# EAGLE schematic Microduino-Core BLE (EAGLE 6.4)
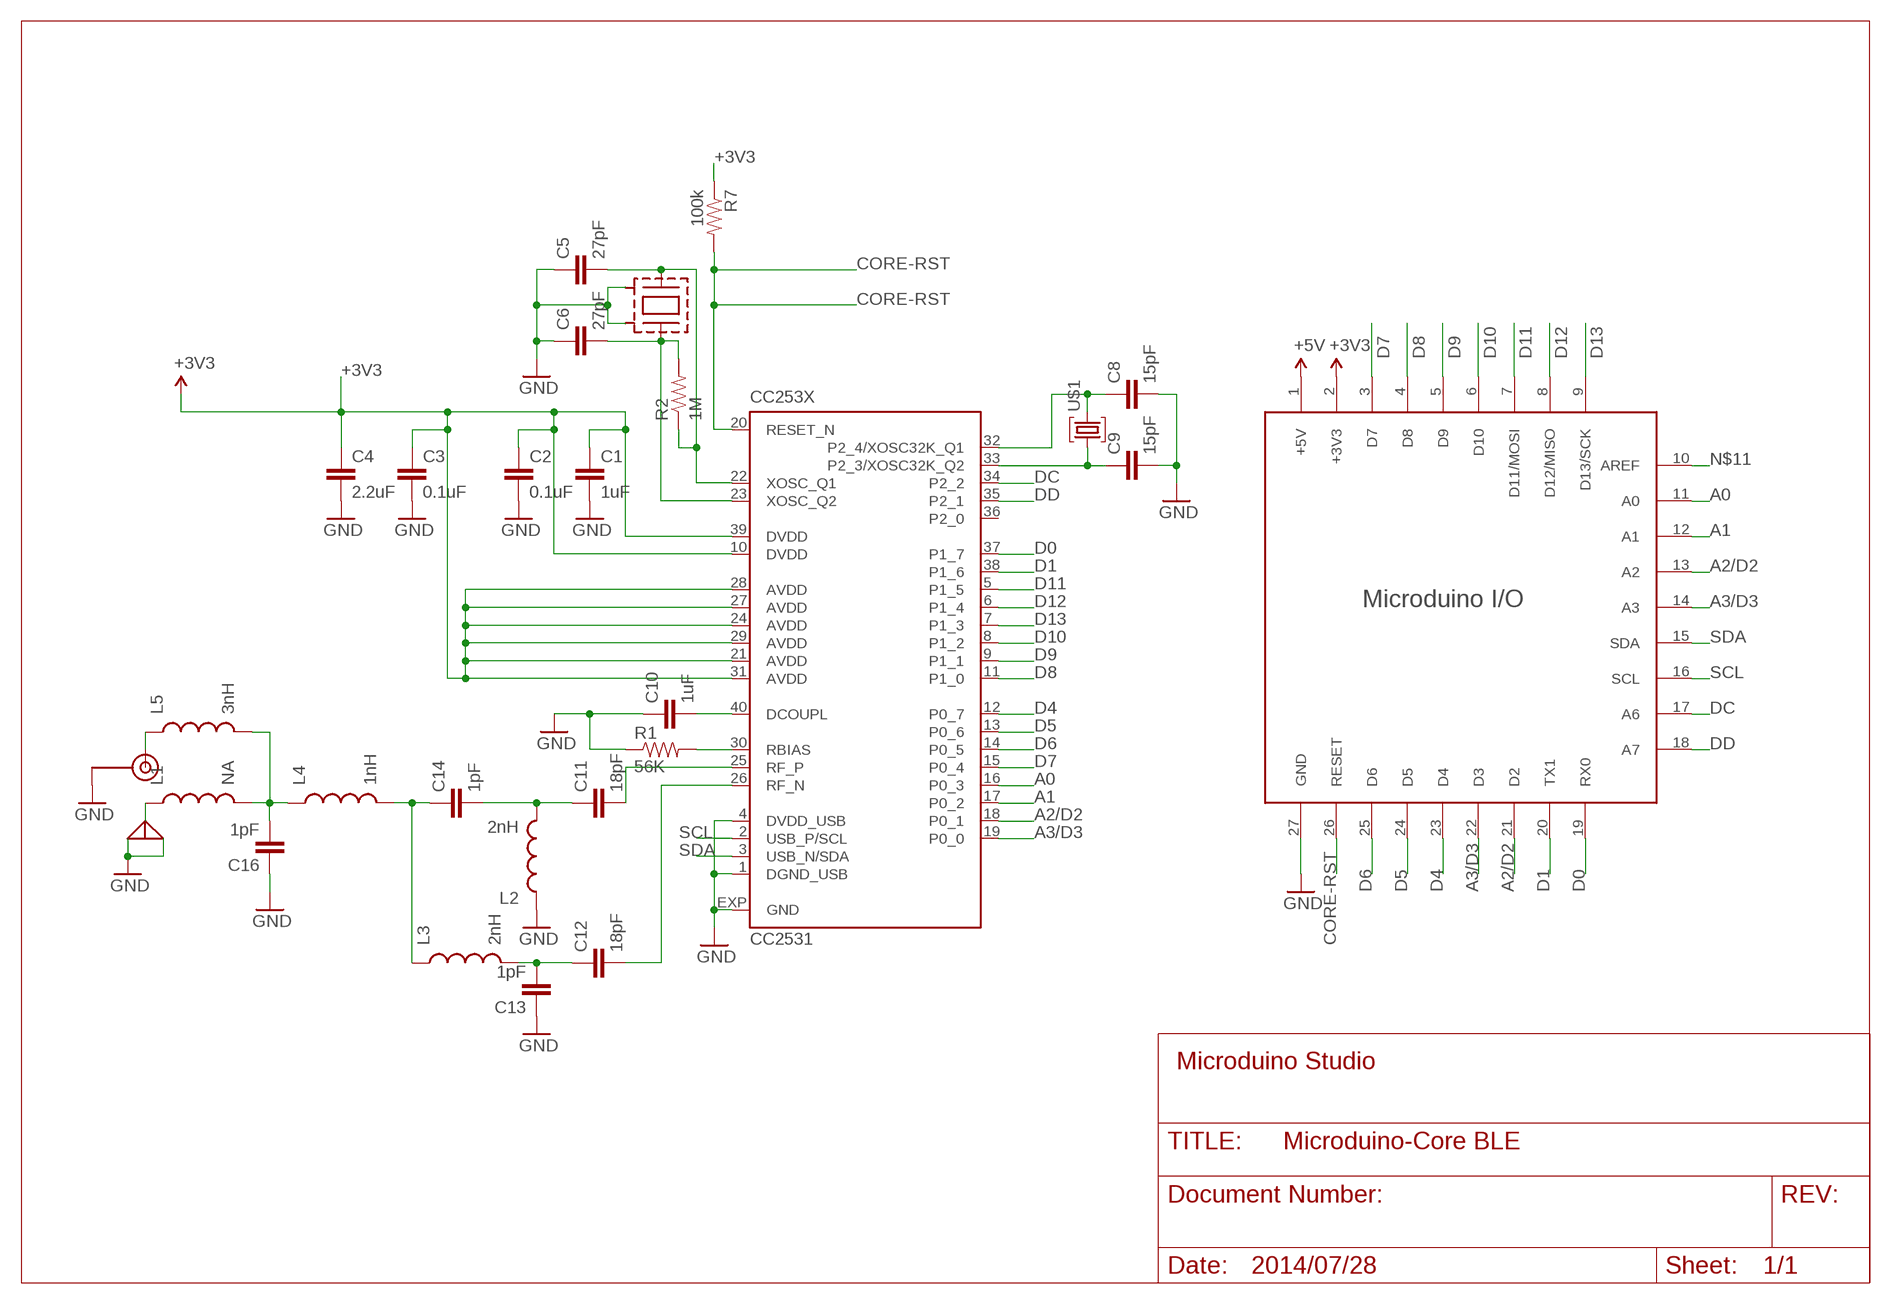
[diagram p0: schematic, sheet 1]

## Parts
C1  1uF  CAP0603-CAP  [0603-CAP]
C2  0.1uF  CAP0402-CAP  [0402-CAP]
C3  0.1uF  CAP0402-CAP  [0402-CAP]
C4  2.2uF  CAP0402-CAP  [0402-CAP]
C5  27pF  CAP0402-CAP  [0402-CAP]
C6  27pF  CAP0402-CAP  [0402-CAP]
C8  15pF  CAP0402-CAP  [0402-CAP]
C9  15pF  CAP0402-CAP  [0402-CAP]
C10  1uF  CAP0603-CAP  [0603-CAP]
C11  18pF  CAP0402-CAP  [0402-CAP]
C12  18pF  CAP0402-CAP  [0402-CAP]
C13  1pF  CAP0402-CAP  [0402-CAP]
C14  1pF  CAP0402-CAP  [0402-CAP]
C16  1pF  CAP0402-CAP  [0402-CAP]
CC253X  CC2531  [RHA_S-PVQFN-N40]
CRYS.1  CRYSTAL-SMD  [CRYSTAL-SMD-3225]
L1  NA  INDUCTOR0402  [C0402]
L2  2nH  INDUCTOR0402  [C0402]
L3  2nH  INDUCTOR0402  [C0402]
L4  1nH  INDUCTOR0402  [C0402]
L5  3nH  INDUCTOR0402  [C0402]
R1  56K  RESISTOR0402-RES  [0402-RES]
R2  1M  RESISTOR0402-RES  [0402-RES]
R7  100k  RESISTOR0402-RES  [0402-RES]
U$1  32.768-3215  [3215-2PIN]
U$2  ANT-2.4G  [ANT2.4G]
U$3  ANT-IPEX  [IPEX]
U$7  MICRDUINO-PINNORMAL  [27UPIN-NORMAL]

## Nets
+3V3: C1.1 C2.1 C3.1 C4.1 CC253X.10(DVDD) CC253X.21(AVDD) CC253X.24(AVDD) CC253X.27(AVDD) CC253X.28(AVDD) CC253X.29(AVDD) CC253X.31(AVDD) CC253X.39(DVDD) R7.1 U$7.2(+3V3)
+5V: U$7.1(+5V)
A0: CC253X.16(P0_3) U$7.11(A0)
A1: CC253X.17(P0_2) U$7.12(A1)
A2/D2: CC253X.18(P0_1) U$7.13(A2) U$7.21(D2)
A3/D3: CC253X.19(P0_0) U$7.14(A3) U$7.22(D3)
CORE-RST: CC253X.20(RESET_N) R7.2 U$7.26(RESET)
D0: CC253X.37(P1_7) U$7.19(RX0)
D1: CC253X.38(P1_6) U$7.20(TX1)
D4: CC253X.12(P0_7) U$7.23(D4)
D5: CC253X.13(P0_6) U$7.24(D5)
D6: CC253X.14(P0_5) U$7.25(D6)
D7: CC253X.15(P0_4) U$7.3(D7)
D8: CC253X.11(P1_0) U$7.4(D8)
D9: CC253X.9(P1_1) U$7.5(D9)
D10: CC253X.8(P1_2) U$7.6(D10)
D11: CC253X.5(P1_5) U$7.7(D11/MOSI)
D12: CC253X.6(P1_4) U$7.8(D12/MISO)
D13: CC253X.7(P1_3) U$7.9(D13/SCK)
DC: CC253X.34(P2_2) U$7.17(A6)
DD: CC253X.35(P2_1) U$7.18(A7)
GND: C1.2 C2.2 C3.2 C4.2 C5.1 C6.1 C8.2 C9.2 C10.1 C13.1 C16.1 CC253X.1(DGND_USB) CC253X.4(DVDD_USB) CC253X.EXP(GND) CRYS.1.2 CRYS.1.4 L2.1 R1.1 U$2.GND(GND2) U$3.1(GND1) U$3.2(GND2) U$7.27(GND)
N$1: C16.2 L1.2 L4.1 L5.2
N$2: C10.2 CC253X.40(DCOUPL)
N$3: C5.2 CC253X.22(XOSC_Q1) CRYS.1.1 R2.1
N$4: C6.2 CC253X.23(XOSC_Q2) CRYS.1.3 R2.2
N$5: CC253X.30(RBIAS) R1.2
N$6: C11.2 CC253X.25(RF_P)
N$7: C12.2 CC253X.26(RF_N)
N$8: C11.1 C14.2 L2.2
N$9: C12.1 C13.2 L3.2
N$10: C14.1 L3.1 L4.2
N$11: U$7.10(AREF)
N$12: L1.1 U$3.3(ANT)
N$13: C8.1 CC253X.32(P2_4/XOSC32K_Q1) U$1.P$2
N$14: C9.1 CC253X.33(P2_3/XOSC32K_Q2) U$1.P$1
N$15: L5.1 U$2.ANT(IN)
SCL: CC253X.2(USB_P/SCL) U$7.16(SCL)
SDA: CC253X.3(USB_N/SDA) U$7.15(SDA)
Unconnected: CC253X.36(P2_0)

## Notes on the sheet
- Microduino Studio
- 2014/07/28

## Library data of the parts
C1-C6 C8-C14 C16 = #_microduino_20131030:CAP: Capacitor Standard 0603 ceramic capacitor, and 0.1" leaded capacitor.
CC253X = texas:CC2531: A USB Enabled System-On-Chip Solution for 2.4-GHz IEEE 802.15.4 and ZigBee Source: http://focus.ti.com/lit/ds/symlink/cc2531.pdf; MPN: CC2531F256RHAT; OC_FARNELL: 1776351; OC_NEWARK: 34R2713
CRYS.1 = MY3:CRYSTAL-SMD
L1-L5 = #_microduino_20131030:INDUCTOR: Inductors Basic Inductor/Choke - 0603 and 1206. Footprints are not proven and vary greatly between part numbers.
R1 R2 R7 = #_microduino_20131030:RESISTOR: Resistor Basic schematic elements and footprints for 0603, 1206, and PTH 1/10th watt (small) resistors.
U$1 = #_PKJ:32.768-3215
U$2 = #_PKJ:ANT-2.4G
U$3 = #_microduino_20131030:ANT-IPEX
U$7 = #_Microduino:MICRDUINO-PIN: microduino引脚封装

## Net classes
0 default: width 0.254 mm, drill 0.61 mm, clearance 0.254 mm